# Altium project Stabilizer_Piezo_Driver.PrjPCB (part 2 of 2)

## Sheet HV_DRV_ADHV4702.SchDoc: ADHV4702-1
size 420 x 297 mm; CheckedBy: G. Kasprowicz; Author: Jakub Kajzer; CompanyName: WUT ISE; DrawnBy: Jakub Kajzer; Organization: WUT ISE; Address1: PW ISE; Address2: Nowowiejska 15/19 00-665 Warsaw; Address3: gkasprow@gmail.com; DocumentNumber: 2; Revision: 2; SheetNumber: 2; SheetTotal: 7; ModifiedBy: -; CreateDate: 03.08.2020; CheckedDate: -; Title2: High Voltage Amplifier; DivGrp: WUT ISE; Designer: Jakub Kajzer; ModifiedDate: -; ProjectName: Sensor Box
Used 2 times, as channels U_HV_DRV_ADHV4702_1, U_HV_DRV_ADHV4702_0. Parts and nets are listed once, with the designators drawn on the sheet.
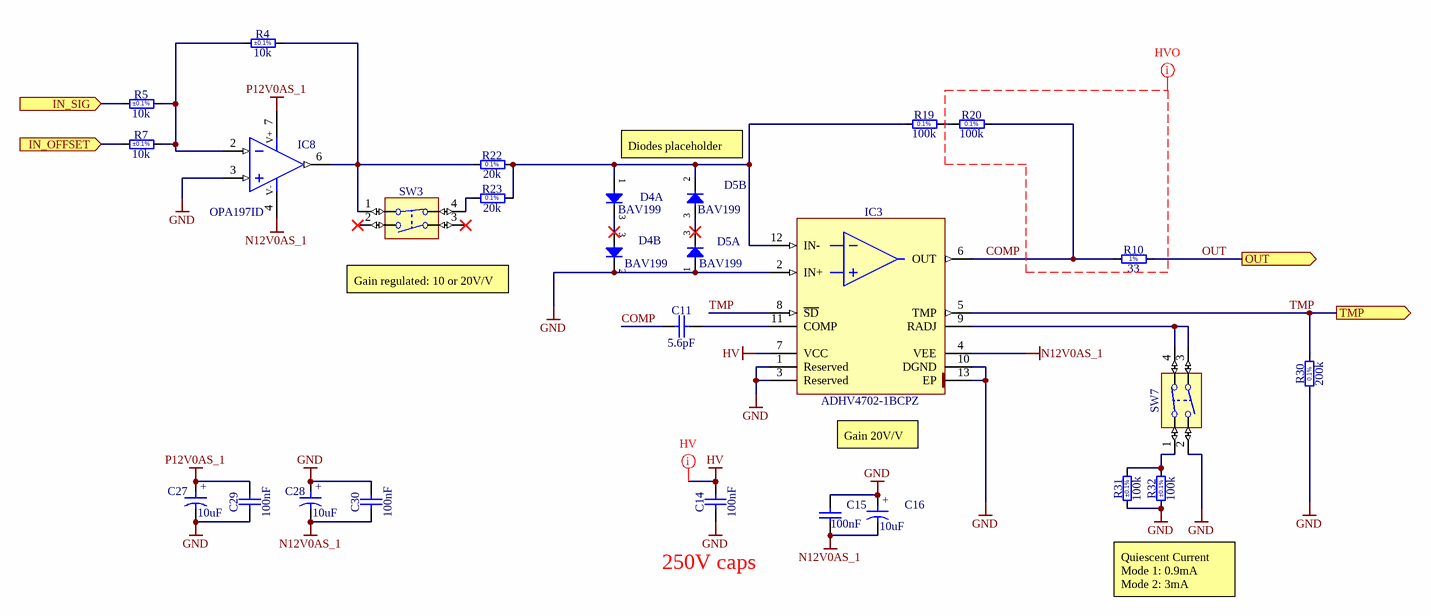
[diagram p3: HV_DRV_ADHV4702.SchDoc]

### Parts
C11  5.6pF  [CAPC2012X135N]
C14  100nF  [CAPC4720X215N]
C15  100nF  [CAPC1005X55N]
C16  10uF  [CAPMP3216X180N]
C27  10uF  [CAPMP3216X180N]
C28  10uF  [CAPMP3216X180N]
C29  100nF  [CAPC1608X87N]
C30  100nF  [CAPC1608X87N]
D4  BAV199  [SOT95P240X110-3N]  (parts A,B of 2)
D5  BAV199  [SOT95P240X110-3N]  (parts A,B of 2)
IC3  ADHV4702-1BCPZ  [QFN170P700X700X80-13N-S290]
IC8  OPA197ID  [SOIC127P600X175-8N]
R4  10k  Tolerance: ±0.1%  [RESC1608X55N]
R5  10k  Tolerance: ±0.1%  [RESC1608X55N]
R7  10k  Tolerance: ±0.1%  [RESC1608X55N]
R10  33  [RESC2012X60N]
R19  100k  [RESC2012X60N]
R20  100k  [RESC2012X60N]
R22  20k  [RESC1608X55N]
R23  20k  [RESC1608X55N]
R30  200k  [RESC1608X55N]
R31  100k  Tolerance: ±0.1%  [RESC1005X35N]
R32  100k  Tolerance: ±0.1%  [RESC1005X35N]
SW3  Switch  [SW_CTS_204-121ST]  (value not drawn)
SW7  Switch  [SW_CTS_204-121ST]  (value not drawn)

### Ports
IN_OFFSET (in), IN_SIG (in), OUT (out), TMP (out)

### Nets
GND: C14.1 C15.2 C16.1 C27.2 C28.1 C29.1 C30.2 D4.2(C) D5.1(A) IC3.1(Reserved) IC3.2(IN+) IC3.3(Reserved) IC3.10(DGND) IC3.13(EP) IC8.3(IN+) R30.1 R31.1 R32.1 SW7.2
HV: C14.2 IC3.7(VCC)
N12V0AS_1: C15.1 C16.2 C28.2 C30.1 IC3.4(VEE) IC8.4(V-)
P12V0AS_1: C27.1 C29.2 IC8.7(V+)
COMP: C11.1 IC3.6(OUT) R10.1 R20.2
IN_OFFSET: R7.1 ; port IN_OFFSET
IN_SIG: R5.1 ; port IN_SIG
OUT: R10.2 ; port OUT
TMP: IC3.5(TMP) IC3.8(~{SD}) R30.2 ; port TMP
NetC11_2: C11.2 IC3.11(COMP)
NetD4_1: D4.1(A) D5.2(C) IC3.12(IN-) R19.1 R22.2 R23.2
NetIC3_9: IC3.9(RADJ) SW7.3 SW7.4
NetIC8_2: IC8.2(IN-) R4.1 R5.2 R7.2
NetIC8_6: IC8.6(OUT) R4.2 R22.1 SW3.1
NetR19_2: R19.2 R20.1
NetR23_1: R23.1 SW3.4
NetR31_2: R31.2 R32.2 SW7.1

Not connected (* = marked no-connect by the designer): D4 3(COMAC)*; D5 3(COMAC)*; SW3 2* 3*

### Channels
U_HV_DRV_ADHV4702_1: designators end in A; ports IN_OFFSET=OFFSET1 IN_SIG=NetR5A_1 OUT=OUT TMP=DRV1_TMP
U_HV_DRV_ADHV4702_0: designators end in B; ports IN_OFFSET=OFFSET0 IN_SIG=NetR5B_1 OUT=OUT TMP=DRV0_TMP

### Layout directives
net class HV: HV
net class HVO: COMP

### Notes on the sheet
- Diodes placeholder
  Text
- (near SW3) Gain regulated: 10 or 20V/V
- Gain 20V/V
- Quiescent Current
  Mode 1: 0.9mA
  Mode 2: 3mA
- Labels drawn without touching a wire or pin: 250V caps
- Project/Equipment
- Document
- Designer
- Drawn by
- Check.by
- Copyright WUT ISE 2018.
  This documentation describes Open Hardware and is licensed under the CERN OHL v.1.1. You may redistribute and modify this documentation under the terms of the CERN OHL v.1.1. (http://ohwr.org/CERNOHL). This documentation is distributed WITHOUT ANY EXPRESS OR IMPLIED WARRANTY, INCLUDING OF MERCHANTABILITY, SATISFACTORY QUALITY AND FITNESS FOR A PARTICULAR PURPOSE. Please see the CERN OHL v.1.1 for applicable conditions.
- Contact
- File
- Last Mod.
- Print Date
- Sheet
- Size
- A3
- of
- Rev
- (in symbol CTE3216-18_10UF_16V_20%_AVX_TCJ) +
- (in symbol R0603_20K_0.1%_0.063W_10PPM) 0.1%
- (in symbol R0603_200K_0.1%_0.063W_10PPM) 0.1%
- (in symbol R0805_33R_1%_0.125W_100PPM) 1%
- (in symbol R0805_100K_0.1%_0.1W_10PPM) 0.1%

### Library data of the parts
C11 = CC0805_5.6PF_50V_0.25PF_NP0: Non-polarised capacitor; Part Number: CC0805_5.6PF_250V_0.25PF_NP0; Part Description: SMD Multilayer Chip Ceramic Capacitor; Manufacturer: GENERIC; Manufacturer1 Part Number: VJ0805D5R6CXPQJHT; Voltage: 250V; TC: C0G/NP0; Tolerance: ±0.25pF; Component Kind: Standard; Component Type: Standard; Pin Count: 2; Value: 5.6pF; Status: Preferred; Manufacturer Part Number: CC0805_5.6PF_250V_0.25PF_NP0; Case: 0805; Mounted: Yes; Socket: No; SMD: Yes; Sense: No; Manufacturer1 Example: Vishay; Manufacturer1 ComponentHeight: 1.35mm; CreateDate: 03.12.2007; LatestRevisionDate: 03.12.2007
C14 = CC1808_100NF_630V_10%_X7R: Non-polarised capacitor; Part Description: SMD Multilayer Chip Ceramic Capacitor; Manufacturer: GENERIC; Manufacturer1 Part Number: C1808C104KBRAC; Voltage: 630V; TC: X7R; Tolerance: ±10%; Part Number: CC1808_100NF_630V_10%_X7R; Component Kind: Standard; Component Type: Standard; Pin Count: 2; Value: 100nF; Status: None; Manufacturer Part Number: CC1808_100NF_630V_10%_X7R; Case: 1808; Mounted: Yes; Socket: No; SMD: Yes; Sense: No; Manufacturer1 Example: KEMET; Manufacturer1 ComponentHeight: 2.15mm; HelpURL: \\cern.ch\dfs\Applications\Altium\Datasheets\CC1808_X7R_KEMET-HV.pdf; Author: CERN DEM MR; CreateDate: 23.11.2016; LatestRevisionDate: 23.11.2016
C15 = CC0402_100NF_16V_10%_X5R: Non-polarised capacitor; Part Description: SMD Multilayer Chip Ceramic Capacitor; Manufacturer: GENERIC; Manufacturer1 Part Number: GRM155R61C104KA88D; Voltage: 16V; TC: X5R; Tolerance: ±10%; Part Number: CC0402_100NF_16V_10%_X5R; Component Kind: Standard; Component Type: Standard; Pin Count: 2; Value: 100nF; Status: None; Manufacturer Part Number: CC0402_100NF_16V_10%_X5R; Case: 0402; Mounted: Yes; Socket: No; SMD: Yes; Sense: No; Manufacturer1 Example: MURATA; Manufacturer1 ComponentHeight: 0.55mm; HelpURL: \\cern.ch\dfs\Applications\Altium\Datasheets\CC0402_X5R_MURATA_GRM.pdf; Author: CERN DEM JLC; CreateDate: 10.12.2013; LatestRevisionDate: 10.12.2013
C16 C27 C28 = CTE3216-18_10UF_16V_20%_AVX_TCJ: Polarised capacitor; Part Description: ESR 0R200 Tantalum Solid Electrolytic Chip Capacitor with Conductive Polymer Electrode; Manufacturer: AVX; Manufacturer Part Number: TCJA106M016R0200; Voltage: 16V; Tolerance: ±20%; Part Number: CTE3216-18_10UF_16V_20%_AVX_TCJ; Component Kind: Standard; Component Type: Standard; Pin Count: 2; Value: 10uF; Status: Preferred; Case: A; Mounted: Yes; Socket: No; SMD: Yes; Sense: No; ComponentHeight: 1.8mm; HelpURL: \\cern.ch\dfs\Applications\Altium\Datasheets\CTE_AVX_TCJ.pdf; Author: CERN DEM JLC; CreateDate: 29.03.2012; LatestRevisionDate: 29.03.2012
C29 C30 = CC0603_100NF_50V_10%_X7R: Non-polarised capacitor; Part Description: SMD Multilayer Chip Ceramic Capacitor; Manufacturer: GENERIC; Manufacturer1 Part Number: 223858615649; Voltage: 50V; TC: X7R; Tolerance: ±10%; Part Number: CC0603_100NF_50V_10%_X7R; Component Kind: Standard; Component Type: Standard; Pin Count: 2; Value: 100nF; Status: Preferred; Manufacturer Part Number: CC0603_100NF_50V_10%_X7R; Case: 0603; Mounted: Yes; Socket: No; SMD: Yes; Sense: No; Manufacturer1 Example: PHYCOMP; Manufacturer1 ComponentHeight: 0.87mm; HelpURL: \\cern.ch\dfs\Applications\Altium\Datasheets\CC0603_X7R_PHYCOMP.pdf; Author: CERN DEM JLC; CreateDate: 03/12/2007; LatestRevisionDate: 03/12/2007
D4 D5 = BAV199: Serial Diode; Part Description: Low-Leakage Double Diode; Manufacturer: NXP SEMICONDUCTORS; Voltage: 75V; Power: 250mW; PressFit: No; Bonding: No; Part Number: BAV199; Component Kind: Standard; Component Type: Standard; Device: BAV199; PackageDescription: SOT23 3-Leads, Pitch 0.95mm - Body 1.4x3mm, IPC Medium Density; Manufacturer Part Number: BAV199; Pin Count: 3; Case: SOT23-3; Mounted: Yes; Socket: No; SMD: Yes; Sense: No; ComponentHeight: 1.1mm; HelpURL: \\cern.ch\dfs\Applications\Altium\Datasheets\BAV199.pdf; Author: CERN DEM JMW; CreateDate: 21.11.2008; LatestRevisionDate: 21.11.2008
IC3 = ADHV4702-1BCPZ: 24V to 220V Precision Operational Amplifier; Manufacturer: ANALOG DEVICES; PressFit: No; Bonding: No; Part Number: ADHV4702-1BCPZ; Component Kind: Standard; Component Type: Standard; Device: ADHV4702-1BCPZ; PackageDescription: QFN, 1.70mm Pitch, Square; 12 pin, 7.00mm L X 7.00mm W X 0.80mm H body (w/Thermal Tab 2.9 X 2.9mm), IPC Medium Density; Part Description: 24V to 220V Precision Operational Amplifier; Manufacturer Part Number: ADHV4702-1BCPZ; Pin Count: 13; Case: QFN12; Mounted: Yes; Socket: No; SMD: Yes; Sense: No; ComponentHeight: 0.8mm; Author: CERN DEM BC; HelpURL: \\cern.ch\dfs\Applications\Altium\Datasheets\ADHV4702-1BCPZ.pdf; CreateDate: 29.08.2019; LatestRevisionDate: 29.08.2019
IC8 = OPA197ID: Operational Amplifier; Part Description: 36-V, Precision, Rail-to-Rail Input/Output, Low Offset Voltage, Operational Amplifiers; Manufacturer: TEXAS INSTRUMENTS; PressFit: No; Bonding: No; Part Number: OPA197ID; Component Kind: Standard; Component Type: Standard; Device: OPA197ID; PackageDescription: SOIC 8, Pitch 1.27mm - Body 4x5mm, IPC Medium Density; Manufacturer Part Number: OPA197ID; Pin Count: 8; Case: SOIC8; Mounted: Yes; Socket: No; SMD: Yes; Sense: No; ComponentHeight: 1.75mm; Author: CERN DEM MR; HelpURL: \\cern.ch\dfs\Applications\Altium\Datasheets\OPA197ID.pdf; CreateDate: 30/06/2017; LatestRevisionDate: 30/06/2017
R4 R5 R7 = R0603_10K_0.1%_0.063W_10PPM: Resistor - 0.1%; Part Description: Thin Film Chip Resistor; Manufacturer: GENERIC; Manufacturer1 Part Number: RN73C1J10KBTDF; Power: 0.063W; TC: ±10ppm; PressFit: No; Part Number: R0603_10K_0.1%_0.063W_10PPM; Component Kind: Standard; Component Type: Standard; Pin Count: 2; Value: 10k; Status: Not Recommended; Manufacturer Part Number: R0603_10K_0.1%_0.063W_10PPM; Case: 0603; Mounted: Yes; Sense: No; Socket: No; SMD: Yes; Manufacturer1 Example: TYCO HOLSWORTHY; Manufacturer1 ComponentHeight: 0.5mm; HelpURL: \\cern.ch\dfs\Applications\Altium\Datasheets\R0603_Tyco_RN73.pdf; Author: CERN DEM JLC; CreateDate: 03.12.2007; LatestRevisionDate: 13.03.2008
R10 = R0805_33R_1%_0.125W_100PPM: Resistor - 1%; Part Description: General Purpose Thick Film Chip Resistor; Manufacturer: GENERIC; Manufacturer1 Part Number: NRC10F33R0TRF; Power: 0.125W; TC: ±100ppm/°C; PressFit: No; Part Number: R0805_33R_1%_0.125W_100PPM; Component Kind: Standard; Component Type: Standard; Pin Count: 2; Value: 33; Status: Preferred; Tolerance: ±1%; Manufacturer Part Number: R0805_33R_1%_0.125W_100PPM; Case: 0805; Mounted: Yes; Sense: No; Socket: No; SMD: Yes; Manufacturer1 Example: NIC COMPONENT; Manufacturer1 ComponentHeight: 0.6mm; HelpURL: \\cern.ch\dfs\Applications\Altium\Datasheets\R0805_NIC_NRC.pdf; Author: CERN DEM JLC; CreateDate: 03.12.2007; LatestRevisionDate: 13.03.2008
R19 R20 = R0805_100K_0.1%_0.1W_10PPM: Resistor - 0.1%; Part Description: Thin Film Chip Resistor; Manufacturer: GENERIC; Manufacturer1 Part Number: RN73C2A100KBTG; Power: 0.1W; TC: ±10ppm; PressFit: No; Part Number: R0805_100K_0.1%_0.1W_10PPM; Component Kind: Standard; Component Type: Standard; Pin Count: 2; Value: 100k; Status: Not Recommended; Tolerance: ±0.1%; Manufacturer Part Number: R0805_100K_0.1%_0.1W_10PPM; Case: 0805; Mounted: Yes; Sense: No; Socket: No; SMD: Yes; Manufacturer1 Example: TYCO HOLSWORTHY; Manufacturer1 ComponentHeight: 0.6mm; HelpURL: \\cern.ch\dfs\Applications\Altium\Datasheets\R0805_Tyco_RN73.pdf; Author: CERN DEM JLC; CreateDate: 03.12.2007; LatestRevisionDate: 13.03.2008
R22 R23 = R0603_20K_0.1%_0.063W_10PPM: Resistor - 0.1%; Part Description: Thin Film Chip Resistor; Manufacturer: GENERIC; Manufacturer1 Part Number: RN73C1J20KBTDF; Power: 0.063W; TC: ±10ppm; PressFit: No; Part Number: R0603_20K_0.1%_0.063W_10PPM; Component Kind: Standard; Component Type: Standard; Pin Count: 2; Value: 20k; Status: Not Recommended; Tolerance: ±0.1%; Manufacturer Part Number: R0603_20K_0.1%_0.063W_10PPM; Case: 0603; Mounted: Yes; Sense: No; Socket: No; SMD: Yes; Manufacturer1 Example: TYCO HOLSWORTHY; Manufacturer1 ComponentHeight: 0.5mm; HelpURL: \\cern.ch\dfs\Applications\Altium\Datasheets\R0603_Tyco_RN73.pdf; Author: CERN DEM JLC; CreateDate: 03.12.2007; LatestRevisionDate: 13.03.2008
R30 = R0603_200K_0.1%_0.063W_10PPM: Resistor - 0.1%; Part Description: Thin Film Chip Resistor; Manufacturer: GENERIC; Manufacturer1 Part Number: RN73C1J200KBTDF; Power: 0.063W; TC: ±10ppm; PressFit: No; Part Number: R0603_200K_0.1%_0.063W_10PPM; Component Kind: Standard; Component Type: Standard; Pin Count: 2; Value: 200k; Status: Not Recommended; Tolerance: ±0.1%; Manufacturer Part Number: R0603_200K_0.1%_0.063W_10PPM; Case: 0603; Mounted: Yes; Sense: No; Socket: No; SMD: Yes; Manufacturer1 Example: TYCO HOLSWORTHY; Manufacturer1 ComponentHeight: 0.5mm; HelpURL: \\cern.ch\dfs\Applications\Altium\Datasheets\R0603_Tyco_RN73.pdf; Author: CERN DEM MR; CreateDate: 12.10.2017; LatestRevisionDate: 12.10.2017
R31 R32 = R0402_100K_0.1%_0.063W_25PPM: Resistor - 0.1%; Part Description: Thin Film Precision Resistor; Manufacturer: GENERIC; Manufacturer1 Part Number: CPF0402B100KE1; Power: 0.063W; TC: ±25ppm/°C; PressFit: No; Part Number: R0402_100K_0.1%_0.063W_25PPM; Component Kind: Standard; Component Type: Standard; Pin Count: 2; Value: 100k; Status: Not Recommended; Manufacturer Part Number: R0402_100K_0.1%_0.063W_25PPM; Case: 0402; Mounted: Yes; Sense: No; Socket: No; SMD: Yes; Manufacturer1 Example: TE CONNECTIVITY; Manufacturer1 ComponentHeight: 0.35mm; HelpURL: \\cern.ch\dfs\Applications\Altium\Datasheets\R0402_TYCO_CPF.pdf; Author: CERN DEM JMW; CreateDate: 22.09.2015; LatestRevisionDate: 22.09.2015
SW3 SW7 = SW_CTS_204-121ST: 2x SPST DIP Switch 1NO + 1NF; Part Description: Single SPDT DIP Switch, (1NO + 1NF Coupled), CTS 204 Series; Manufacturer: CTS; PressFit: No; Part Number: SW_CTS_204-121ST; Component Kind: Standard; Component Type: Standard; Pin Count: 4; PackageDescription: Body 7.26 x 9.78mm, 2x SPST DIP, 1NO + 1NF Switch, CTS 204 Series; Family: Switch; Mounted: Yes; Socket: No; SMD: Yes; Sense: No; Status: None; Manufacturer Part Number: 204-121ST; ComponentHeight: 10.36mm; HelpURL: \\cern.ch\dfs\Applications\Altium\Datasheets\SW_CTS_204-121ST.pdf; Author: CERN DEM JLC; CreateDate: 28.08.2014; LatestRevisionDate: 28.08.2014

## Sheet HV_DRV_PA15FLA.SchDoc: PA15FLA
size 420 x 297 mm; CheckedBy: G. Kasprowicz; Author: Jakub Kajzer; CompanyName: WUT ISE; DrawnBy: Jakub Kajzer; Organization: WUT ISE; Address1: PW ISE; Address2: Nowowiejska 15/19 00-665 Warsaw; Address3: gkasprow@gmail.com; DocumentNumber: 3; Revision: 2; SheetNumber: 3; SheetTotal: 7; ModifiedBy: -; CreateDate: 03.08.2020; CheckedDate: -; Title2: High Voltage Amplifier; DivGrp: WUT ISE; Designer: Jakub Kajzer; ModifiedDate: -; ProjectName: Sensor Box
Used 2 times, as channels U_HV_DRV_PA15FLA_0, U_HV_DRV_PA15FLA_1. Parts and nets are listed once, with the designators drawn on the sheet.
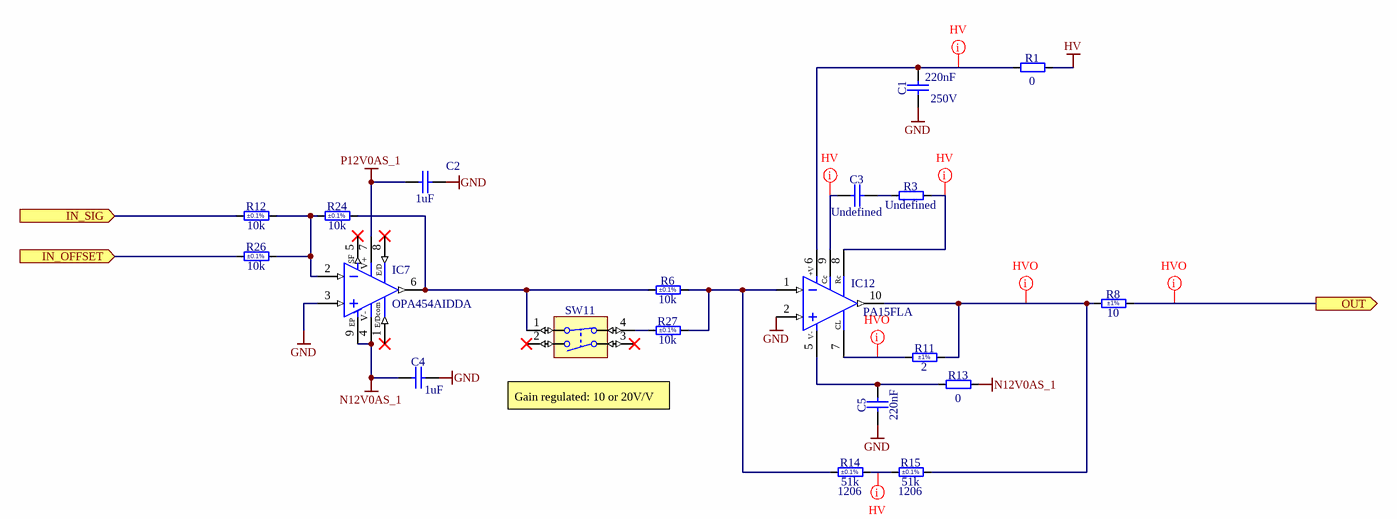
[diagram p4: HV_DRV_PA15FLA.SchDoc]

### Parts
C1  220nF  Voltage: 250V  [CAPC4532X165N]
C2  1uF  [CAPC1608X87N]
C3  Undefined  [CAPC3216X140N]
C4  1uF  [CAPC1608X87N]
C5  220nF  [CAPC1608X87N]
IC7  OPA454AIDDA  [SOIC127P600X170-9N-R249X300]
IC12  PA15FLA  [APEX_PA15FL_v]
R1  0  [RESC1608X55N]
R3  Undefined  [RESC3216X65N]
R6  10k  Tolerance: ±0.1%  [RESC1608X64N]
R8  10  Tolerance: ±1%  [RESC3216X65N]
R11  2  Tolerance: ±1%  [RESC1608X55N]
R12  10k  Tolerance: ±0.1%  [RESC1608X55N]
R13  0  [RESC1608X55N]
R14  51k  Tolerance: ±0.1%  Case: 1206  [RESC3216X65N]
R15  51k  Tolerance: ±0.1%  Case: 1206  [RESC3216X65N]
R24  10k  Tolerance: ±0.1%  [RESC1608X55N]
R26  10k  Tolerance: ±0.1%  [RESC1608X55N]
R27  10k  Tolerance: ±0.1%  [RESC1608X64N]
SW11  Switch  [SW_CTS_204-121ST]  (value not drawn)

### Ports
IN_OFFSET (in), IN_SIG (in), OUT (out)

### Nets
GND: C1.1 C2.2 C4.2 C5.1 IC7.3(IN+) IC12.2(IN+)
HV: R1.2
N12V0AS_1: C4.1 IC7.4(V-) IC7.9(Exposed_Pad) R13.2
P12V0AS_1: C2.1 IC7.7(V+)
IN_OFFSET: R26.1 ; port IN_OFFSET
IN_SIG: R12.1 ; port IN_SIG
OUT: R8.2 ; port OUT
NetC1_2: C1.2 IC12.6(+Vs) R1.1
NetC3_1: C3.1 IC12.9(Cc)
NetC3_2: C3.2 R3.1
NetC5_2: C5.2 IC12.5(-Vs) R13.1
NetIC7_2: IC7.2(IN-) R12.2 R24.1 R26.2
NetIC7_6: IC7.6(OUT) R6.1 R24.2 SW11.1
NetIC12_1: IC12.1(IN-) R6.2 R14.1 R27.2
NetIC12_7: IC12.7(CL) R11.1
NetIC12_8: IC12.8(Cc2) R3.2
NetIC12_10: IC12.10(OUT) R8.1 R11.2 R15.2
NetR14_2: R14.2 R15.1
NetR27_1: R27.1 SW11.4

Not connected (* = marked no-connect by the designer): IC7 1(E/Dcommon)* 5(Status_Flag)* 8(E/B)*; SW11 2* 3*

### Channels
U_HV_DRV_PA15FLA_0: designators end in A; ports IN_OFFSET=OFFSET0 IN_SIG=NetR12A_1 OUT=NetR8A_2
U_HV_DRV_PA15FLA_1: designators end in B; ports IN_OFFSET=OFFSET1 IN_SIG=NetR12B_1 OUT=NetR8B_2

### Layout directives
net class HVO: NetIC12A_7, NetIC12A_10, NetR8A_2
net class HV: NetC1A_2, NetC3A_1, NetIC12A_8, NetR14A_2

### Notes on the sheet
- Gain regulated: 10 or 20V/V
- Project/Equipment
- Document
- Designer
- Drawn by
- Check.by
- Copyright WUT ISE 2018.
  This documentation describes Open Hardware and is licensed under the CERN OHL v.1.1. You may redistribute and modify this documentation under the terms of the CERN OHL v.1.1. (http://ohwr.org/CERNOHL). This documentation is distributed WITHOUT ANY EXPRESS OR IMPLIED WARRANTY, INCLUDING OF MERCHANTABILITY, SATISFACTORY QUALITY AND FITNESS FOR A PARTICULAR PURPOSE. Please see the CERN OHL v.1.1 for applicable conditions.
- Contact
- File
- Last Mod.
- Print Date
- Sheet
- Size
- A3
- of
- Rev
- (in symbol OPA454AIDDA) SF; E/D; E/Dcom; EP
- (in symbol PA15FLA_v) +V; Rc; V-

### Library data of the parts
C1 = CC1812_220NF_250V_10%_X7R_FT-CAP: Non-polarised capacitor; Part Description: Flexible Termination System (FT-CAP) SMD Multilayer Ceramic  Chip Capacitor; Manufacturer: KEMET; Manufacturer Part Number: C1812X224KARACTU; TC: X7R; Tolerance: ±10%; Part Number: CC1812_220NF_250V_10%_X7R_FT-CAP; Component Kind: Standard; Component Type: Standard; Pin Count: 2; Value: 220nF; Status: None; Case: 1812; Mounted: Yes; Socket: No; SMD: Yes; Sense: No; ComponentHeight: 1.65mm; HelpURL: \\cern.ch\dfs\Applications\Altium\Datasheets\CC1812_X7R_KEMET_FT-CAP.pdf; Author: CERN DEM JLC; CreateDate: 09.08.2018; LatestRevisionDate: 09.08.2018
C2 C4 = CC0603_1UF_50V_10%_X5R: Non-polarised capacitor; Part Description: SMD Multilayer Chip Ceramic Capacitor; Manufacturer: GENERIC; Manufacturer1 Part Number: C1608X5R1H105K080; Voltage: 50V; TC: X5R; Tolerance: ±10%; Part Number: CC0603_1UF_50V_10%_X5R; Component Kind: Standard; Component Type: Standard; Pin Count: 2; Value: 1uF; Status: None; Manufacturer Part Number: CC0603_1UF_50V_10%_X5R; Case: 0603; Mounted: Yes; Socket: No; SMD: Yes; Sense: No; Manufacturer1 Example: TDK; Manufacturer1 ComponentHeight: 0.9mm; HelpURL: \\cern.ch\dfs\Applications\Altium\Datasheets\CC0603_X5R_TDK_C.pdf; Author: CERN DEM JMW; CreateDate: 09.11.2015; LatestRevisionDate: 09.11.2015
C3 = CC1206_NO-VALUE: Non-polarised capacitor; Part Description: Reserved Footprint For a 1206 (3216) Chip Ceramic Capacitor; Mounted: No; Part Number: CC1206_NO-VALUE; Component Kind: Standard; Component Type: Standard; Pin Count: 2; Value: Undefined; Status: None; Manufacturer: Undefined; Manufacturer Part Number: CC1206_NO-VALUE; Case: 1206; Socket: No; SMD: Yes; Sense: No; Manufacturer1 ComponentHeight: 1.4mm; HelpURL: Undefined; Author: CERN DEM JLC; CreateDate: 05.05.2008; LatestRevisionDate: 16.11.2009
C5 = CC0603_220NF_25V_10%_X7R: Non-polarised capacitor; Part Description: SMD Multilayer Chip Ceramic Capacitor; Manufacturer: GENERIC; Manufacturer1 Part Number: C0603C224K3RACTU; Voltage: 25V; TC: X7R; Tolerance: ±10%; Part Number: CC0603_220NF_25V_10%_X7R; Component Kind: Standard; Component Type: Standard; Pin Count: 2; Value: 220nF; Status: Preferred; Manufacturer Part Number: CC0603_220NF_25V_10%_X7R; Case: 0603; Mounted: Yes; Socket: No; SMD: Yes; Sense: No; Manufacturer1 Example: KEMET; Manufacturer1 ComponentHeight: 0.87mm; HelpURL: \\cern.ch\dfs\Applications\Altium\Datasheets\CC0603_X7R_KEMET.pdf; Author: CERN DEM JLC; CreateDate: 29.10.2014; LatestRevisionDate: 29.10.2014
IC7 = OPA454AIDDA: High-Voltage (100V), High-Current (50mA) Operational Amplifier, G=1 Stable; Manufacturer: TEXAS INSTRUMENTS; PressFit: No; Bonding: No; Part Number: OPA454AIDDA; Component Kind: Standard; Component Type: Standard; Device: OPA454AIDDA; PackageDescription: SOIC, 1.27mm Pitch; 8 Pin, 4.00mm W X 5.00mm L X 1.70mm H body (w/Thermal Tab 2.49 X 3.00mm), IPC Medium Density; Part Description: High-Voltage (100V), High-Current (50mA) Operational Amplifier, G=1 Stable; Manufacturer Part Number: OPA454AIDDA; Pin Count: 9; Case: SOIC8; Mounted: Yes; Socket: No; SMD: Yes; Sense: No; ComponentHeight: 1.70mm; Author: CERN DEM JLC; HelpURL: \\cern.ch\dfs\Applications\Altium\Datasheets\OPA454AIDDA.pdf; CreateDate: 23.05.2011; LatestRevisionDate: 23.05.2011
IC12 = PA15FLA_v: High Voltage Power Operational Amplifier; Part Description: 200mA 450V High Voltage Power Operational Amplifier (FL Case Style); Manufacturer: APEX MICROTECHNOLOGY; PressFit: No; Bonding: No; Part Number: PA15FLA_v; Component Kind: Standard; Component Type: Standard; Device: PA15FLA; PackageDescription: Power 10 Pin SIP, DP Package Style, Pitch 2.54mm, Straight Leads For Vertical Mount; Manufacturer Part Number: PA15FLA; Pin Count: 10; Mounted: Yes; Socket: No; SMD: No; Sense: No; ComponentHeight: 23.14mm; Author: CERN DEM BC; HelpURL: \\cern.ch\dfs\Applications\Altium\Datasheets\PA15FLA.pdf; CreateDate: 08.06.2021; LatestRevisionDate: 08.06.2021
R1 R13 = R0603_0R_JUMPER: Resistor; Part Description: 1A (0.05R Max DC Resistance) Zero Ohm Jumper; Manufacturer: GENERIC; Manufacturer1 Part Number: NRC06Z0; PressFit: No; Part Number: R0603_0R_JUMPER; Component Kind: Standard; Component Type: Standard; Pin Count: 2; Value: 0; Status: Preferred; Manufacturer Part Number: R0603_0R_JUMPER; Case: 0603; Mounted: Yes; Sense: No; Socket: No; SMD: Yes; Manufacturer1 Example: NIC COMPONENT; Manufacturer1 ComponentHeight: 0.55mm; HelpURL: \\cern.ch\dfs\Applications\Altium\Datasheets\R0603_NIC_NRC.pdf; Author: CERN DEM JLC; CreateDate: 03.12.2007; LatestRevisionDate: 13.03.2008
R3 = R1206_NO-VALUE: Resistor; Part Description: Reserved Footprint For a 1206 (3216) Chip Resistor; PressFit: No; Mounted: No; Part Number: R1206_NO-VALUE; Component Kind: Standard; Component Type: Standard; Pin Count: 2; Value: Undefined; Status: None; Manufacturer: Undefined; Manufacturer Part Number: R1206_NO-VALUE; Case: 1206; Sense: No; Socket: No; SMD: Yes; Manufacturer1 Example: Undefined; Manufacturer1 Part Number: Undefined; Manufacturer1 ComponentHeight: Undefined; HelpURL: Undefined; Author: CERN DEM JLC; CreateDate: 03.12.2007; LatestRevisionDate: 13.03.2008
R6 R27 = R0603_10K_0.1%_0.1W_25PPM: Resistor - 0.1%; Part Description: Thin Film Chip Resistor; Manufacturer: GENERIC; Manufacturer1 Part Number: ERA3AEB103V; Power: 0.1W; TC: ±25ppm/°C; PressFit: No; Part Number: R0603_10K_0.1%_0.1W_25PPM; Component Kind: Standard; Component Type: Standard; Pin Count: 2; Value: 10k; Status: Not Recommended; Manufacturer Part Number: R0603_10K_0.1%_0.1W_25PPM; Case: 0603; Mounted: Yes; Sense: No; Socket: No; SMD: Yes; Manufacturer1 Example: PANASONIC; Manufacturer1 ComponentHeight: 0.55mm; HelpURL: \\cern.ch\dfs\Applications\Altium\Datasheets\R0603_PANASONIC_ERA.pdf; Author: CERN DEM JMW; CreateDate: 09.11.2015; LatestRevisionDate: 11.01.2017
R8 = R1206_10R_1%_0.25W_200PPM: Resistor - 1%; Part Description: General Purpose Thick Film Chip Resistor; Manufacturer: GENERIC; Manufacturer1 Part Number: NRC12F10R0TRF; Power: 0.25W; TC: ±200ppm/°C; PressFit: No; Part Number: R1206_10R_1%_0.25W_200PPM; Component Kind: Standard; Component Type: Standard; Pin Count: 2; Value: 10; Status: Preferred; Manufacturer Part Number: R1206_10R_1%_0.25W_200PPM; Case: 1206; Mounted: Yes; Sense: No; Socket: No; SMD: Yes; Manufacturer1 Example: NIC COMPONENT; Manufacturer1 ComponentHeight: 0.65mm; HelpURL: \\cern.ch\dfs\Applications\Altium\Datasheets\R1206_NIC_NRC.pdf; Author: CERN DEM JLC; CreateDate: 24.06.2009; LatestRevisionDate: 24.06.2009
R11 = R0603_2R_1%_0.1W_200PPM: Resistor - 1%; Part Description: General Purpose Thick Film Chip Resistor; Manufacturer: GENERIC; Manufacturer1 Part Number: 232270462008L or RC0603FR-072RL; Power: 0.1W; TC: ±200ppm/°C; PressFit: No; Part Number: R0603_2R_1%_0.1W_200PPM; Component Kind: Standard; Component Type: Standard; Pin Count: 2; Value: 2; Status: Preferred; Manufacturer Part Number: R0603_2R_1%_0.1W_200PPM; Case: 0603; Mounted: Yes; Sense: No; Socket: No; SMD: Yes; Manufacturer1 Example: YAGEO PHYCOMP; Manufacturer1 ComponentHeight: 0.65mm; HelpURL: \\cern.ch\dfs\Applications\Altium\Datasheets\R0603_Tyco_RN73.pdf; Author: CERN DEM JLC; CreateDate: 03.12.2007; LatestRevisionDate: 17.10.2012
R12 R24 R26 = R0603_10K_0.1%_0.063W_10PPM: as R4 on sheet HV_DRV_ADHV4702; Part Number: R0603_10K_0.1%_0.063W_10PPM; Component Kind: Standard; Component Type: Standard; Pin Count: 2; Value: 10k; Status: Not Recommended; Manufacturer Part Number: R0603_10K_0.1%_0.063W_10PPM; Case: 0603; Mounted: Yes; Sense: No; Socket: No; SMD: Yes; Manufacturer1 Example: TYCO HOLSWORTHY; Manufacturer1 ComponentHeight: 0.5mm; HelpURL: \\cern.ch\dfs\Applications\Altium\Datasheets\R0603_Tyco_RN73.pdf; Author: CERN DEM JLC; CreateDate: 03.12.2007; LatestRevisionDate: 13.03.2008
R14 R15 = R1206_51K_0.1%_0.25W_25PPM: Resistor - 0.1%; Part Description: Thin Film Chip Resistor; Manufacturer: GENERIC; Manufacturer1 Part Number: RN73H2BTTD5102B25; Power: 0.25W; TC: ±25ppm/°C; PressFit: No; Part Number: R1206_51K_0.1%_0.25W_25PPM; Component Kind: Standard; Component Type: Standard; Pin Count: 2; Value: 51k; Status: Not Recommended; Manufacturer Part Number: R1206_51K_0.1%_0.25W_25PPM; Mounted: Yes; Sense: No; Socket: No; SMD: Yes; Manufacturer1 Example: KOA; Manufacturer1 ComponentHeight: 0.70mm; HelpURL: \\cern.ch\dfs\Applications\Altium\Datasheets\R1206_KOA_RN73H.pdf; Author: CERN DEM JLC; CreateDate: 03.12.2007; LatestRevisionDate: 13.03.2008
SW11 = SW_CTS_204-121ST: as SW3 on sheet HV_DRV_ADHV4702; Part Number: SW_CTS_204-121ST; Component Kind: Standard; Component Type: Standard; Pin Count: 4; PackageDescription: Body 7.26 x 9.78mm, 2x SPST DIP, 1NO + 1NF Switch, CTS 204 Series; Family: Switch; Mounted: Yes; Socket: No; SMD: Yes; Sense: No; Status: None; Manufacturer Part Number: 204-121ST; ComponentHeight: 10.36mm; HelpURL: \\cern.ch\dfs\Applications\Altium\Datasheets\SW_CTS_204-121ST.pdf; Author: CERN DEM JLC; CreateDate: 28.08.2014; LatestRevisionDate: 28.08.2014

## Sheet overtemp_indicator.SchDoc: Overtemperature
size 420 x 297 mm; CheckedBy: G. Kasprowicz; Author: Jakub Kajzer; CompanyName: WUT ISE; DrawnBy: Jakub Kajzer; Organization: WUT ISE; Address1: PW ISE; Address2: Nowowiejska 15/19 00-665 Warsaw; Address3: gkasprow@gmail.com; DocumentNumber: 6; Revision: 2; SheetNumber: 6; SheetTotal: 7; ModifiedBy: -; CreateDate: 03.08.2020; CheckedDate: -; Title2: Indicator; DivGrp: WUT ISE; Designer: Jakub Kajzer; ModifiedDate: -; ProjectName: Sensor Box
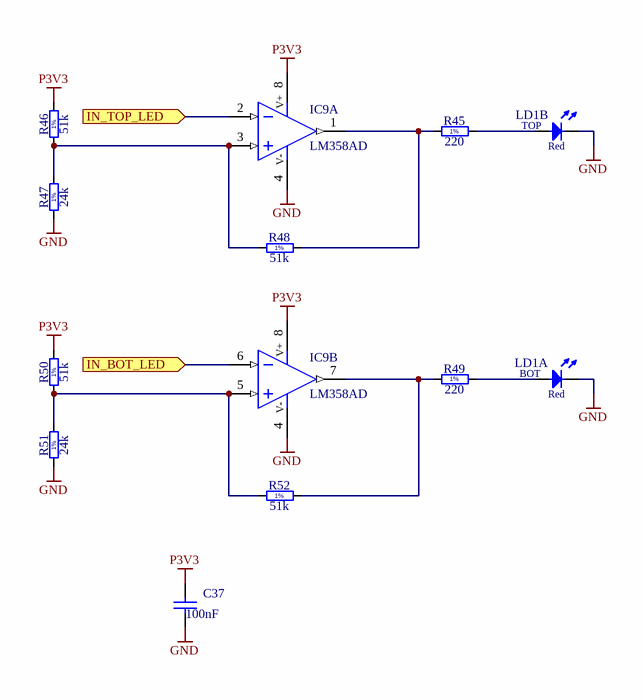
[diagram p5: overtemp_indicator.SchDoc]

### Parts
C37  100nF  [CAPC1005X55N]
IC9  LM358AD  [SOIC127P600X175-8N]  (parts A,B of 2)
LD1  Red/Red  [LED_DIALIGHT_571-0111F]  (value not drawn)  (parts A,B of 2)
R45  220  [RESC1608X55N]
R46  51k  [RESC1608X55N]
R47  24k  [RESC1608X55N]
R48  51k  [RESC1608X55N]
R49  220  [RESC1608X55N]
R50  51k  [RESC1608X55N]
R51  24k  [RESC1608X55N]
R52  51k  [RESC1608X55N]

### Ports
IN_BOT_LED (in), IN_TOP_LED (in)

### Nets
GND: C37.1 IC9.4(V-) LD1.1(C) LD1.3(C) R47.1 R51.1
P3V3: C37.2 IC9.8(V+) R46.2 R50.2
DRV0_TMP: IC9.2(IN-) ; port IN_TOP_LED
DRV1_TMP: IC9.6(IN-) ; port IN_BOT_LED
NetIC9_1: IC9.1(OUT) R45.1 R48.2
NetIC9_3: IC9.3(IN+) R46.1 R47.2 R48.1
NetIC9_5: IC9.5(IN+) R50.1 R51.2 R52.1
NetIC9_7: IC9.7(OUT) R49.1 R52.2
NetLD1_2: LD1.2(A) R49.2
NetLD1_4: LD1.4(A) R45.2

### Notes on the sheet
- Project/Equipment
- Document
- Designer
- Drawn by
- Check.by
- Copyright WUT ISE 2018.
  This documentation describes Open Hardware and is licensed under the CERN OHL v.1.1. You may redistribute and modify this documentation under the terms of the CERN OHL v.1.1. (http://ohwr.org/CERNOHL). This documentation is distributed WITHOUT ANY EXPRESS OR IMPLIED WARRANTY, INCLUDING OF MERCHANTABILITY, SATISFACTORY QUALITY AND FITNESS FOR A PARTICULAR PURPOSE. Please see the CERN OHL v.1.1 for applicable conditions.
- Contact
- File
- Last Mod.
- Print Date
- Sheet
- Size
- A3
- of
- Rev
- (in symbol LED_DIALIGHT_571-0111F, part A) BOT; Red
- (in symbol LED_DIALIGHT_571-0111F, part B) TOP; Red
- (in symbol R0603_24K_1%_0.1W_100PPM) 1%
- (in symbol R0603_51K_1%_0.1W_100PPM) 1%
- (in symbol R0603_220R_1%_0.1W_100PPM) 1%

### Library data of the parts
C37 = CC0402_100NF_16V_10%_X5R: as C15 on sheet HV_DRV_ADHV4702; Part Number: CC0402_100NF_16V_10%_X5R; Component Kind: Standard; Component Type: Standard; Pin Count: 2; Value: 100nF; Status: None; Manufacturer Part Number: CC0402_100NF_16V_10%_X5R; Case: 0402; Mounted: Yes; Socket: No; SMD: Yes; Sense: No; Manufacturer1 Example: MURATA; Manufacturer1 ComponentHeight: 0.55mm; HelpURL: \\cern.ch\dfs\Applications\Altium\Datasheets\CC0402_X5R_MURATA_GRM.pdf; Author: CERN DEM JLC; CreateDate: 10.12.2013; LatestRevisionDate: 10.12.2013
IC9 = LM358AD: Dual Operational Amplifier; Manufacturer: TEXAS INSTRUMENTS; PressFit: No; Bonding: No; Part Number: LM358AD; Component Kind: Standard; Component Type: Standard; Device: LM358AD; PackageDescription: SOIC 8, Pitch 1.27mm - Body 4x5mm, IPC Medium Density; Part Description: Dual Operational Amplifier; Manufacturer Part Number: LM358AD; Pin Count: 8; Case: SOIC8; Mounted: Yes; Socket: No; SMD: Yes; Sense: No; ComponentHeight: 1.75mm; Author: CERN DEM JLC; HelpURL: \\cern.ch\dfs\Applications\Altium\Datasheets\LM358AD.pdf; CreateDate: 02.12.2008; LatestRevisionDate: 13.04.2010
LD1 = LED_DIALIGHT_571-0111F: LED x2 Red 1C2A-BOT_3C4A-TOP; Part Description: Dual 2mm Red LEDs CBI® Circuit Board Indicator (Without positioning pins); PressFit: No; Bonding: No; Part Number: LED_DIALIGHT_571-0111F; Component Kind: Standard; Component Type: Standard; Color: Red/Red; PackageDescription: 2x 2mm Red LED PCB Edge Mounting (Without positioning pins) DIALIGHT 571 Serie; Manufacturer: DIALIGHT; Manufacturer Part Number: 571-0111F; Pin Count: 4; Mounted: Yes; Socket: No; SMD: No; Sense: No; ComponentHeight: 8.6mm; HelpURL: \\cern.ch\dfs\Applications\Altium\Datasheets\LED_DIALIGHT_571-0111F.pdf; Author: CERN DEM JLC; CreateDate: 09.11.2009; LatestRevisionDate: 17.03.2010
R45 R49 = R0603_220R_1%_0.1W_100PPM: Resistor - 1%; Part Description: General Purpose Thick Film Chip Resistor; Manufacturer: GENERIC; Manufacturer1 Part Number: NRC06F2200TRF; Power: 0.1W; TC: ±100ppm/°C; PressFit: No; Part Number: R0603_220R_1%_0.1W_100PPM; Component Kind: Standard; Component Type: Standard; Pin Count: 2; Value: 220; Status: Preferred; Tolerance: ±1%; Manufacturer Part Number: R0603_220R_1%_0.1W_100PPM; Case: 0603; Mounted: Yes; Sense: No; Socket: No; SMD: Yes; Manufacturer1 Example: NIC COMPONENT; Manufacturer1 ComponentHeight: 0.55mm; HelpURL: \\cern.ch\dfs\Applications\Altium\Datasheets\R0603_NIC_NRC.pdf; Author: CERN DEM JLC; CreateDate: 03.12.2007; LatestRevisionDate: 13.03.2008
R46 R48 R50 R52 = R0603_51K_1%_0.1W_100PPM: Resistor - 1%; Part Description: General Purpose Thick Film Chip Resistor; Manufacturer: GENERIC; Manufacturer1 Part Number: NRC06F5102TRF; Power: 0.1W; TC: ±100ppm/°C; PressFit: No; Part Number: R0603_51K_1%_0.1W_100PPM; Component Kind: Standard; Component Type: Standard; Pin Count: 2; Value: 51k; Status: Preferred; Tolerance: ±1%; Manufacturer Part Number: R0603_51K_1%_0.1W_100PPM; Case: 0603; Mounted: Yes; Sense: No; Socket: No; SMD: Yes; Manufacturer1 Example: NIC COMPONENT; Manufacturer1 ComponentHeight: 0.55mm; HelpURL: \\cern.ch\dfs\Applications\Altium\Datasheets\R0603_NIC_NRC.pdf; Author: CERN DEM JLC; CreateDate: 03.12.2007; LatestRevisionDate: 13.03.2008
R47 R51 = R0603_24K_1%_0.1W_100PPM: Resistor - 1%; Part Description: General Purpose Thick Film Chip Resistor; Manufacturer: GENERIC; Manufacturer1 Part Number: NRC06F2402TRF; Power: 0.1W; TC: ±100ppm/°C; PressFit: No; Part Number: R0603_24K_1%_0.1W_100PPM; Component Kind: Standard; Component Type: Standard; Pin Count: 2; Value: 24k; Status: Preferred; Tolerance: ±1%; Manufacturer Part Number: R0603_24K_1%_0.1W_100PPM; Case: 0603; Mounted: Yes; Sense: No; Socket: No; SMD: Yes; Manufacturer1 Example: NIC COMPONENT; Manufacturer1 ComponentHeight: 0.55mm; HelpURL: \\cern.ch\dfs\Applications\Altium\Datasheets\R0603_NIC_NRC.pdf; Author: CERN DEM JLC; CreateDate: 03.12.2007; LatestRevisionDate: 13.03.2008

## Sheet Offset_Selector.SchDoc: Offset
size 420 x 297 mm; CheckedBy: G. Kasprowicz; Author: Jakub Kajzer; CompanyName: WUT ISE; DrawnBy: Jakub Kajzer; Organization: WUT ISE; Address1: PW ISE; Address2: Nowowiejska 15/19 00-665 Warsaw; Address3: gkasprow@gmail.com; DocumentNumber: 4; Revision: 2; SheetNumber: 4; SheetTotal: 7; ModifiedBy: -; CreateDate: 03.08.2020; CheckedDate: -; Title2: Selector; DivGrp: WUT ISE; Designer: Jakub Kajzer; ModifiedDate: -; ProjectName: Sensor Box
Used 2 times, as channels Offset_selector0, Offset_selector1. Parts and nets are listed once, with the designators drawn on the sheet.
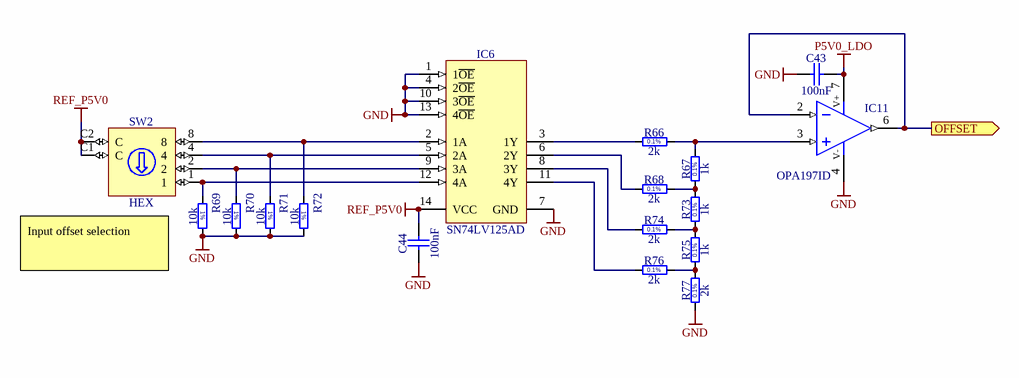
[diagram p6: Offset_Selector.SchDoc]

### Parts
C43  100nF  [CAPC1608X87N]
C44  100nF  [CAPC1608X87N]
IC6  SN74LV125AD  [SOIC127P600X175-14N]
IC11  OPA197ID  [SOIC127P600X175-8N]
R66  2k  [RESC1608X55N]
R67  1k  [RESC1608X55N]
R68  2k  [RESC1608X55N]
R69  10k  [RESC1608X55N]
R70  10k  [RESC1608X55N]
R71  10k  [RESC1608X55N]
R72  10k  [RESC1608X55N]
R73  1k  [RESC1608X55N]
R74  2k  [RESC1608X55N]
R75  1k  [RESC1608X55N]
R76  2k  [RESC1608X55N]
R77  2k  [RESC1608X55N]
SW2  HEX  [SW_APEM_PT65106L254]

### Ports
OFFSET (out)

### Nets
GND: C43.1 C44.1 IC6.1(1~{OE}) IC6.4(2~{OE}) IC6.7(GND) IC6.10(3~{OE}) IC6.13(4~{OE}) IC11.4(V-) R69.2 R70.2 R71.2 R72.2 R77.1
P5V0_LDO: C43.2 IC11.7(V+)
REF_P5V0: C44.2 IC6.14(VCC) SW2.C1(C) SW2.C2(C)
OFFSET: IC11.2(IN-) IC11.6(OUT) ; port OFFSET
NetIC6_2: IC6.2(1A) R72.1 SW2.8
NetIC6_3: IC6.3(1Y) R66.1
NetIC6_5: IC6.5(2A) R71.1 SW2.4
NetIC6_6: IC6.6(2Y) R68.1
NetIC6_8: IC6.8(3Y) R74.1
NetIC6_9: IC6.9(3A) R70.1 SW2.2
NetIC6_11: IC6.11(4Y) R76.1
NetIC6_12: IC6.12(4A) R69.1 SW2.1
NetIC11_3: IC11.3(IN+) R66.2 R67.2
NetR67_1: R67.1 R68.2 R73.2
NetR73_1: R73.1 R74.2 R75.2
NetR75_1: R75.1 R76.2 R77.2

### Channels
Offset_selector0: designators end in A; ports OFFSET=OFFSET0
Offset_selector1: designators end in B; ports OFFSET=OFFSET1

### Notes on the sheet
- Input offset selection
- Project/Equipment
- Document
- Designer
- Drawn by
- Check.by
- Copyright WUT ISE 2018.
  This documentation describes Open Hardware and is licensed under the CERN OHL v.1.1. You may redistribute and modify this documentation under the terms of the CERN OHL v.1.1. (http://ohwr.org/CERNOHL). This documentation is distributed WITHOUT ANY EXPRESS OR IMPLIED WARRANTY, INCLUDING OF MERCHANTABILITY, SATISFACTORY QUALITY AND FITNESS FOR A PARTICULAR PURPOSE. Please see the CERN OHL v.1.1 for applicable conditions.
- Contact
- File
- Last Mod.
- Print Date
- Sheet
- Size
- A3
- of
- Rev
- (in symbol R0603_1K0_0.1%_0.063W_10PPM) 0.1%
- (in symbol R0603_2K_0.1%_0.063W_10PPM) 0.1%
- (in symbol R0603_10K_1%_0.1W_100PPM) 1%

### Library data of the parts
C43 C44 = CC0603_100NF_50V_10%_X7R: as C29 on sheet HV_DRV_ADHV4702; Part Number: CC0603_100NF_50V_10%_X7R; Component Kind: Standard; Component Type: Standard; Pin Count: 2; Value: 100nF; Status: Preferred; Manufacturer Part Number: CC0603_100NF_50V_10%_X7R; Case: 0603; Mounted: Yes; Socket: No; SMD: Yes; Sense: No; Manufacturer1 Example: PHYCOMP; Manufacturer1 ComponentHeight: 0.87mm; HelpURL: \\cern.ch\dfs\Applications\Altium\Datasheets\CC0603_X7R_PHYCOMP.pdf; Author: CERN DEM JLC; CreateDate: 03/12/2007; LatestRevisionDate: 03/12/2007
IC6 = SN74LV125AD: Quadruple Bus Buffer with 3-State Outputs; Manufacturer: TEXAS INSTRUMENTS; PressFit: No; Bonding: No; Part Number: SN74LV125AD; Component Kind: Standard; Component Type: Standard; Device: SN74LV125AD; PackageDescription: SOIC 14, Pitch 1.27mm - Body 4x8.75mm, IPC Medium Density; Part Description: Quadruple Bus Buffer with 3-State Outputs; Manufacturer Part Number: SN74LV125AD; Pin Count: 14; Case: SOIC14; Mounted: Yes; Socket: No; SMD: Yes; Sense: No; ComponentHeight: 1.75mm; Author: CERN DEM JLC; HelpURL: \\cern.ch\dfs\Applications\Altium\Datasheets\SN74LV125AD.pdf; CreateDate: 09.03.2011; LatestRevisionDate: 09.03.2011
IC11 = OPA197ID: as IC8 on sheet HV_DRV_ADHV4702; Part Number: OPA197ID; Component Kind: Standard; Component Type: Standard; Device: OPA197ID; PackageDescription: SOIC 8, Pitch 1.27mm - Body 4x5mm, IPC Medium Density; Manufacturer Part Number: OPA197ID; Pin Count: 8; Case: SOIC8; Mounted: Yes; Socket: No; SMD: Yes; Sense: No; ComponentHeight: 1.75mm; Author: CERN DEM MR; HelpURL: \\cern.ch\dfs\Applications\Altium\Datasheets\OPA197ID.pdf; CreateDate: 30/06/2017; LatestRevisionDate: 30/06/2017
R66 R68 R74 R76 R77 = R0603_2K_0.1%_0.063W_10PPM: Resistor - 0.1%; Part Description: Thin Film Chip Resistor; Manufacturer: GENERIC; Manufacturer1 Part Number: RN73C1J2K0BTDF; Power: 0.063W; TC: ±10ppm; PressFit: No; Part Number: R0603_2K_0.1%_0.063W_10PPM; Component Kind: Standard; Component Type: Standard; Pin Count: 2; Value: 2k; Status: Not Recommended; Tolerance: ±0.1%; Manufacturer Part Number: R0603_2K_0.1%_0.063W_10PPM; Case: 0603; Mounted: Yes; Sense: No; Socket: No; SMD: Yes; Manufacturer1 Example: TYCO HOLSWORTHY; Manufacturer1 ComponentHeight: 0.5mm; HelpURL: \\cern.ch\dfs\Applications\Altium\Datasheets\R0603_Tyco_RN73.pdf; Author: CERN DEM JLC; CreateDate: 03.12.2007; LatestRevisionDate: 13.03.2008
R67 R73 R75 = R0603_1K0_0.1%_0.063W_10PPM: Resistor - 0.1%; Part Description: Thin Film Chip Resistor; Manufacturer: GENERIC; Manufacturer1 Part Number: RN73C1J1K0BTDF; Power: 0.063W; TC: ±10ppm; PressFit: No; Part Number: R0603_1K0_0.1%_0.063W_10PPM; Component Kind: Standard; Component Type: Standard; Pin Count: 2; Value: 1k; Status: Not Recommended; Tolerance: ±0.1%; Manufacturer Part Number: R0603_1K0_0.1%_0.063W_10PPM; Case: 0603; Mounted: Yes; Sense: No; Socket: No; SMD: Yes; Manufacturer1 Example: TYCO HOLSWORTHY; Manufacturer1 ComponentHeight: 0.5mm; HelpURL: \\cern.ch\dfs\Applications\Altium\Datasheets\R0603_Tyco_RN73.pdf; Author: CERN DEM JLC; CreateDate: 03.12.2007; LatestRevisionDate: 13.03.2008
R69-R72 = R0603_10K_1%_0.1W_100PPM: Resistor - 1%; Part Description: General Purpose Thick Film Chip Resistor; Manufacturer: GENERIC; Manufacturer1 Part Number: NRC06F1002TRF; Power: 0.1W; TC: ±100ppm/°C; PressFit: No; Part Number: R0603_10K_1%_0.1W_100PPM; Component Kind: Standard; Component Type: Standard; Pin Count: 2; Value: 10k; Status: Preferred; Tolerance: ±1%; Manufacturer Part Number: R0603_10K_1%_0.1W_100PPM; Case: 0603; Mounted: Yes; Sense: No; Socket: No; SMD: Yes; Manufacturer1 Example: NIC COMPONENT; Manufacturer1 ComponentHeight: 0.55mm; HelpURL: \\cern.ch\dfs\Applications\Altium\Datasheets\R0603_NIC_NRC.pdf; Author: CERN DEM JLC; CreateDate: 03.12.2007; LatestRevisionDate: 13.03.2008
SW2 = SW_APEM_PT65106L254: Rotary Code Switch 1 2 4 8 C1 C2; Part Description: Rotary Hexadecimal Right Angled Switch, Screwdriver Actuator, Straight terminals; Manufacturer: APEM; PressFit: No; Part Number: SW_APEM_PT65106L254; Component Kind: Standard; Component Type: Standard; Pin Count: 6; PackageDescription: Body 10x10mm, Right Angled Rotary Hexadecimal Code Switch With Screwdriver Actuator, APEM PT65 (CR65) Series; Family: HEX; Mounted: Yes; Socket: No; SMD: No; Sense: No; Status: None; Manufacturer Part Number: PT65106L254; ComponentHeight: 10mm; HelpURL: \\cern.ch\dfs\Applications\Altium\Datasheets\SW_APEM_PT65106L254.pdf; Author: CERN DEM JLC; CreateDate: 18.06.2014; LatestRevisionDate: 18.06.2014

## Nets that join several sheets
GND: Stabilizer_Piezo_Driver (45 pins), power_supplies (42 pins), mechanics (R43.1 R44.1), U_HV_DRV_ADHV4702_1 (19 pins), U_HV_DRV_PA15FLA_0 (6 pins), U_HV_DRV_PA15FLA_1 (6 pins), overtemp_indicator (6 pins), Offset_selector0 (13 pins), Offset_selector1 (13 pins), U_HV_DRV_ADHV4702_0 (19 pins)
HV: power_supplies (5 pins), U_HV_DRV_ADHV4702_1 (C14A.2 IC3A.7), U_HV_DRV_PA15FLA_0 (R1A.2), U_HV_DRV_PA15FLA_1 (R1B.2), U_HV_DRV_ADHV4702_0 (C14B.2 IC3B.7)
N12V0AS_1: Stabilizer_Piezo_Driver (J2.16), U_HV_DRV_ADHV4702_1 (6 pins), U_HV_DRV_PA15FLA_0 (C4A.1 IC7A.4 IC7A.9 R13A.2), U_HV_DRV_PA15FLA_1 (C4B.1 IC7B.4 IC7B.9 R13B.2), U_HV_DRV_ADHV4702_0 (6 pins)
P3V3: Stabilizer_Piezo_Driver (J5.34), overtemp_indicator (C37.2 IC9.8 R46.2 R50.2)
P5V0_LDO: power_supplies (C22.1 C24.2 IC1.1 IC1.2), Offset_selector0 (C43A.2 IC11A.7), Offset_selector1 (C43B.2 IC11B.7)
P12V0: Stabilizer_Piezo_Driver (5 pins), power_supplies (15 pins)
P12V0AS_1: Stabilizer_Piezo_Driver (J2.15), U_HV_DRV_ADHV4702_1 (C27A.1 C29A.2 IC8A.7), U_HV_DRV_PA15FLA_0 (C2A.1 IC7A.7), U_HV_DRV_PA15FLA_1 (C2B.1 IC7B.7), U_HV_DRV_ADHV4702_0 (C27B.1 C29B.2 IC8B.7)
REF_P5V0: power_supplies (C31.1 C41.1 C42.2 IC4.6), Offset_selector0 (C44A.2 IC6A.14 SW2A.C1 SW2A.C2), Offset_selector1 (C44B.2 IC6B.14 SW2B.C1 SW2B.C2)
DRV0_TMP: overtemp_indicator (IC9.2), U_HV_DRV_ADHV4702_0 (IC3B.5 IC3B.8 R30B.2)
DRV1_TMP: U_HV_DRV_ADHV4702_1 (IC3A.5 IC3A.8 R30A.2), overtemp_indicator (IC9.6)
NetR5A_1: Stabilizer_Piezo_Driver (SW9.1), U_HV_DRV_ADHV4702_1 (R5A.1)
NetR5B_1: Stabilizer_Piezo_Driver (SW5.1), U_HV_DRV_ADHV4702_0 (R5B.1)
NetR8A_2: Stabilizer_Piezo_Driver (SW6.3), U_HV_DRV_PA15FLA_0 (R8A.2)
NetR8B_2: Stabilizer_Piezo_Driver (SW10.3), U_HV_DRV_PA15FLA_1 (R8B.2)
NetR12A_1: Stabilizer_Piezo_Driver (SW5.3), U_HV_DRV_PA15FLA_0 (R12A.1)
NetR12B_1: Stabilizer_Piezo_Driver (SW9.3), U_HV_DRV_PA15FLA_1 (R12B.1)
OFFSET0: U_HV_DRV_PA15FLA_0 (R26A.1), Offset_selector0 (IC11A.2 IC11A.6), U_HV_DRV_ADHV4702_0 (R7B.1)
OFFSET1: U_HV_DRV_ADHV4702_1 (R7A.1), U_HV_DRV_PA15FLA_1 (R26B.1), Offset_selector1 (IC11B.2 IC11B.6)
OUT: Stabilizer_Piezo_Driver (SW10.1), U_HV_DRV_ADHV4702_1 (R10A.2)
OUT: Stabilizer_Piezo_Driver (SW6.1), U_HV_DRV_ADHV4702_0 (R10B.2)

## Assembly variants
92..200V: not fitted IC5 R43 R44
50..135V: not fitted IC2 R43 R44